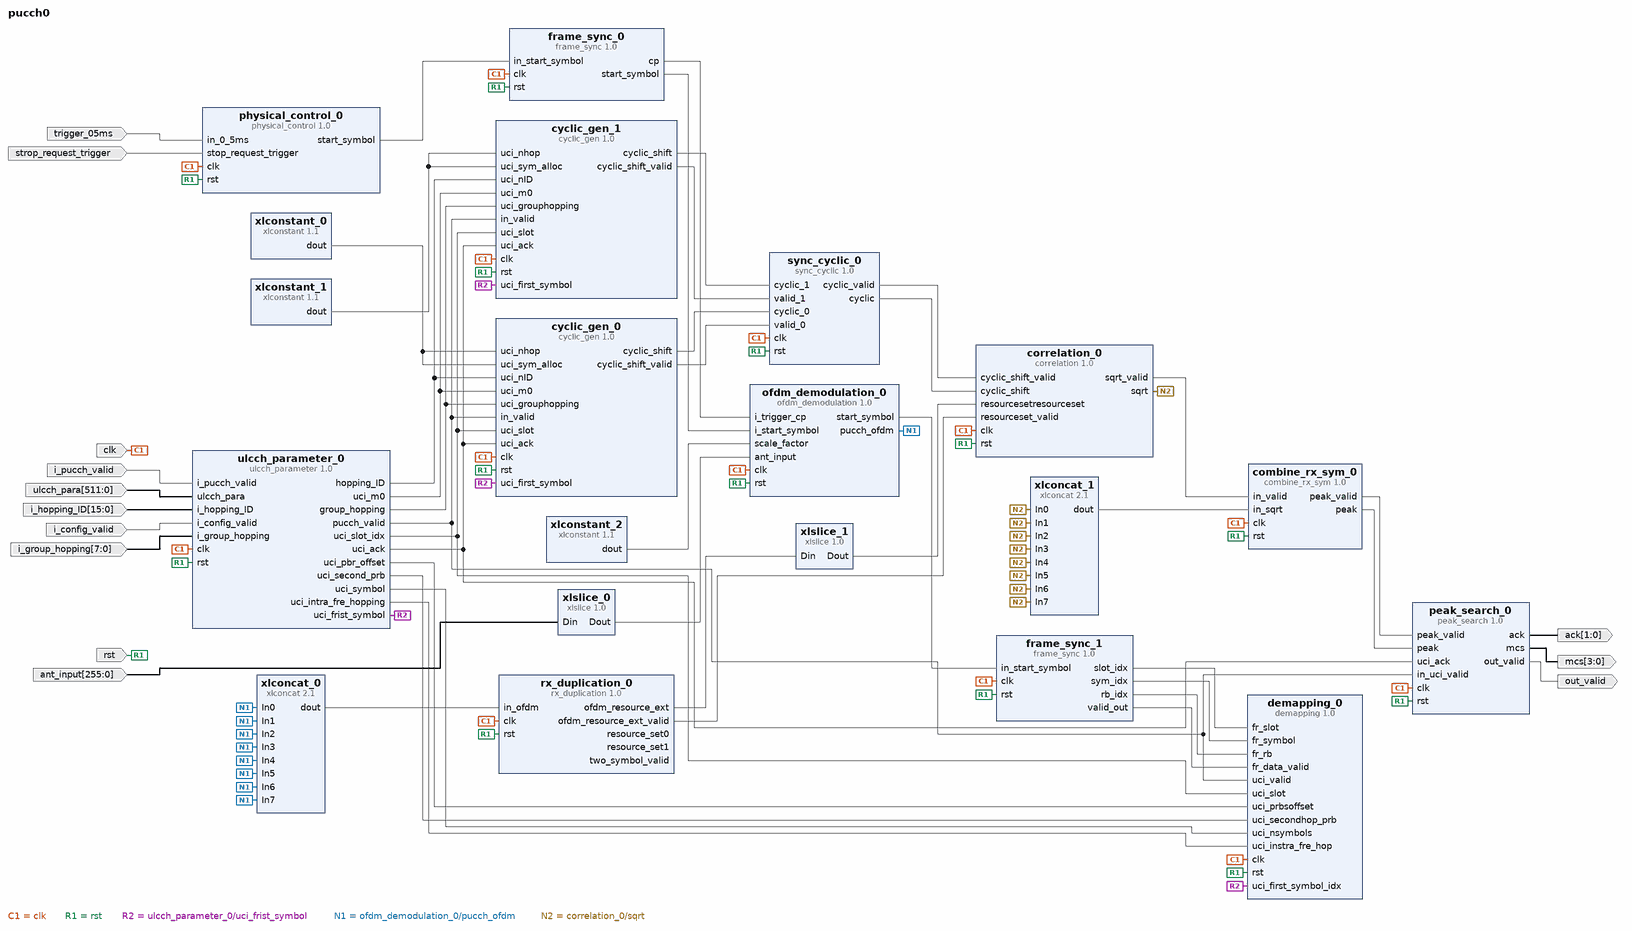
[diagram p0: block diagram of the top level]
# Vivado block design pucch0, xcvu9p-flga2104-2L-e, Vivado 2019.2
create_bd_design pucch0

create_bd_port -dir I -type clk clk
set_property -dict {CONFIG.FREQ_HZ 122880000} [get_bd_ports clk]
create_bd_port -dir I -type rst rst
set_property -dict {CONFIG.POLARITY ACTIVE_HIGH} [get_bd_ports rst]
create_bd_port -dir I trigger_05ms
create_bd_port -dir I strop_request_trigger
create_bd_port -dir I i_pucch_valid
create_bd_port -dir I -from 511 -to 0 -type data ulcch_para
create_bd_port -dir I -from 7 -to 0 i_group_hopping
create_bd_port -dir O out_valid
create_bd_port -dir O -from 1 -to 0 ack
create_bd_port -dir O -from 3 -to 0 mcs
create_bd_port -dir I -from 255 -to 0 ant_input
create_bd_port -dir I -from 15 -to 0 i_hopping_ID
create_bd_port -dir I i_config_valid

create_bd_cell -type ip -vlnv xilinx.com:user:physical_control:1.0 physical_control_0
create_bd_cell -type ip -vlnv xilinx.com:user:peak_search:1.0 peak_search_0
create_bd_cell -type ip -vlnv xilinx.com:ip:xlconstant:1.1 xlconstant_0
set_property -dict {CONFIG.CONST_VAL 0} [get_bd_cells xlconstant_0]
create_bd_cell -type ip -vlnv xilinx.com:ip:xlconstant:1.1 xlconstant_1
set_property -dict {CONFIG.CONST_VAL 1} [get_bd_cells xlconstant_1]
create_bd_cell -type ip -vlnv xilinx.com:ip:xlconcat:2.1 xlconcat_0
set_property -dict [list \
  CONFIG.IN0_WIDTH 32 \
  CONFIG.IN1_WIDTH 32 \
  CONFIG.IN2_WIDTH 32 \
  CONFIG.IN3_WIDTH 32 \
  CONFIG.IN4_WIDTH 32 \
  CONFIG.IN5_WIDTH 32 \
  CONFIG.IN6_WIDTH 32 \
  CONFIG.IN7_WIDTH 32 \
  CONFIG.NUM_PORTS 8 \
] [get_bd_cells xlconcat_0]
create_bd_cell -type ip -vlnv xilinx.com:ip:xlconstant:1.1 xlconstant_2
set_property -dict {CONFIG.CONST_VAL 3 CONFIG.CONST_WIDTH 3} [get_bd_cells xlconstant_2]
create_bd_cell -type ip -vlnv xilinx.com:ip:xlslice:1.0 xlslice_0
set_property -dict {CONFIG.DIN_FROM 31 CONFIG.DIN_TO 0 CONFIG.DIN_WIDTH 256 CONFIG.DOUT_WIDTH 32} [get_bd_cells xlslice_0]
create_bd_cell -type ip -vlnv xilinx.com:user:frame_sync:1.0 frame_sync_0
create_bd_cell -type ip -vlnv xilinx.com:user:frame_sync:1.0 frame_sync_1
create_bd_cell -type ip -vlnv xilinx.com:user:cyclic_gen:1.0 cyclic_gen_0
create_bd_cell -type ip -vlnv xilinx.com:user:cyclic_gen:1.0 cyclic_gen_1
create_bd_cell -type ip -vlnv xilinx.com:user:ofdm_demodulation:1.0 ofdm_demodulation_0
create_bd_cell -type ip -vlnv xilinx.com:user:ulcch_parameter:1.0 ulcch_parameter_0
create_bd_cell -type ip -vlnv xilinx.com:ip:xlslice:1.0 xlslice_1
set_property -dict {CONFIG.DIN_FROM 31 CONFIG.DIN_TO 0 CONFIG.DIN_WIDTH 256 CONFIG.DOUT_WIDTH 32} [get_bd_cells xlslice_1]
create_bd_cell -type ip -vlnv xilinx.com:ip:xlconcat:2.1 xlconcat_1
set_property -dict [list \
  CONFIG.IN0_WIDTH 20 \
  CONFIG.IN1_WIDTH 20 \
  CONFIG.IN2_WIDTH 20 \
  CONFIG.IN3_WIDTH 20 \
  CONFIG.IN4_WIDTH 20 \
  CONFIG.IN5_WIDTH 20 \
  CONFIG.IN6_WIDTH 20 \
  CONFIG.IN7_WIDTH 20 \
  CONFIG.NUM_PORTS 8 \
] [get_bd_cells xlconcat_1]
create_bd_cell -type ip -vlnv xilinx.com:user:rx_duplication:1.0 rx_duplication_0
set_property -dict {CONFIG.RX_num 8} [get_bd_cells rx_duplication_0]
create_bd_cell -type ip -vlnv xilinx.com:user:sync_cyclic:1.0 sync_cyclic_0
create_bd_cell -type ip -vlnv xilinx.com:user:correlation:1.0 correlation_0
create_bd_cell -type ip -vlnv xilinx.com:user:combine_rx_sym:1.0 combine_rx_sym_0
create_bd_cell -type ip -vlnv xilinx.com:user:demapping:1.0 demapping_0

# ---- connections ----

connect_bd_net [get_bd_ports clk] \
  [get_bd_pins physical_control_0/clk] [get_bd_pins peak_search_0/clk] [get_bd_pins frame_sync_0/clk] \
  [get_bd_pins frame_sync_1/clk] [get_bd_pins cyclic_gen_0/clk] [get_bd_pins cyclic_gen_1/clk] \
  [get_bd_pins ofdm_demodulation_0/clk] [get_bd_pins ulcch_parameter_0/clk] [get_bd_pins rx_duplication_0/clk] \
  [get_bd_pins sync_cyclic_0/clk] [get_bd_pins correlation_0/clk] [get_bd_pins combine_rx_sym_0/clk] \
  [get_bd_pins demapping_0/clk]
connect_bd_net [get_bd_ports rst] \
  [get_bd_pins physical_control_0/rst] [get_bd_pins peak_search_0/rst] [get_bd_pins frame_sync_0/rst] \
  [get_bd_pins frame_sync_1/rst] [get_bd_pins cyclic_gen_0/rst] [get_bd_pins cyclic_gen_1/rst] \
  [get_bd_pins ofdm_demodulation_0/rst] [get_bd_pins ulcch_parameter_0/rst] [get_bd_pins rx_duplication_0/rst] \
  [get_bd_pins sync_cyclic_0/rst] [get_bd_pins correlation_0/rst] [get_bd_pins combine_rx_sym_0/rst] \
  [get_bd_pins demapping_0/rst]
connect_bd_net [get_bd_ports trigger_05ms] [get_bd_pins physical_control_0/in_0_5ms]
connect_bd_net [get_bd_ports strop_request_trigger] [get_bd_pins physical_control_0/stop_request_trigger]
connect_bd_net [get_bd_pins physical_control_0/start_symbol] [get_bd_pins frame_sync_0/in_start_symbol]
connect_bd_net -net layer2_valid_1 [get_bd_ports i_pucch_valid] [get_bd_pins ulcch_parameter_0/i_pucch_valid]
connect_bd_net -net layer2_para_1 [get_bd_ports ulcch_para] [get_bd_pins ulcch_parameter_0/ulcch_para]
connect_bd_net -net layer2_parameter_0_uci_valid [get_bd_pins ulcch_parameter_0/pucch_valid] \
  [get_bd_pins peak_search_0/in_uci_valid] [get_bd_pins cyclic_gen_0/in_valid] [get_bd_pins cyclic_gen_1/in_valid] \
  [get_bd_pins demapping_0/uci_valid]
connect_bd_net -net slot_ind_1 [get_bd_pins ulcch_parameter_0/uci_slot_idx] \
  [get_bd_pins cyclic_gen_0/uci_slot] [get_bd_pins cyclic_gen_1/uci_slot] [get_bd_pins demapping_0/uci_slot]
connect_bd_net -net layer2_parameter_0_uci_frist_symbol [get_bd_pins ulcch_parameter_0/uci_frist_symbol] \
  [get_bd_pins cyclic_gen_0/uci_first_symbol] [get_bd_pins cyclic_gen_1/uci_first_symbol] \
  [get_bd_pins demapping_0/uci_first_symbol_idx]
# net demapping_0_resoureset0_valid has one end: rx_duplication_0/resource_set0
# net demapping_0_resoureset1_valid has one end: rx_duplication_0/resource_set1
# net demapping_0_two_symbol_valid has one end: rx_duplication_0/two_symbol_valid
connect_bd_net -net layer2_parameter_0_uci_nid [get_bd_pins ulcch_parameter_0/hopping_ID] \
  [get_bd_pins cyclic_gen_0/uci_nID] [get_bd_pins cyclic_gen_1/uci_nID]
connect_bd_net -net layer2_parameter_0_uci_m0 [get_bd_pins ulcch_parameter_0/uci_m0] \
  [get_bd_pins cyclic_gen_0/uci_m0] [get_bd_pins cyclic_gen_1/uci_m0]
connect_bd_net -net layer2_parameter_0_uci_ack [get_bd_pins ulcch_parameter_0/uci_ack] \
  [get_bd_pins peak_search_0/uci_ack] [get_bd_pins cyclic_gen_0/uci_ack] [get_bd_pins cyclic_gen_1/uci_ack]
connect_bd_net -net group_hopping_1 [get_bd_pins ulcch_parameter_0/group_hopping] \
  [get_bd_pins cyclic_gen_0/uci_grouphopping] [get_bd_pins cyclic_gen_1/uci_grouphopping]
connect_bd_net -net xlconstant_0_dout [get_bd_pins xlconstant_1/dout] [get_bd_pins cyclic_gen_1/uci_sym_alloc] [get_bd_pins cyclic_gen_1/uci_nhop]
connect_bd_net [get_bd_pins sync_cyclic_0/cyclic_valid] [get_bd_pins correlation_0/cyclic_shift_valid]
connect_bd_net [get_bd_pins sync_cyclic_0/cyclic] [get_bd_pins correlation_0/cyclic_shift]
connect_bd_net [get_bd_pins rx_duplication_0/ofdm_resource_ext_valid] [get_bd_pins correlation_0/resourceset_valid]
connect_bd_net [get_bd_pins correlation_0/sqrt_valid] [get_bd_pins combine_rx_sym_0/in_valid]
connect_bd_net [get_bd_pins combine_rx_sym_0/peak_valid] [get_bd_pins peak_search_0/peak_valid]
connect_bd_net [get_bd_pins combine_rx_sym_0/peak] [get_bd_pins peak_search_0/peak]
connect_bd_net [get_bd_pins peak_search_0/ack] [get_bd_ports ack]
connect_bd_net [get_bd_pins peak_search_0/out_valid] [get_bd_ports out_valid]
connect_bd_net [get_bd_pins peak_search_0/mcs] [get_bd_ports mcs]
connect_bd_net [get_bd_pins frame_sync_1/slot_idx] [get_bd_pins demapping_0/fr_slot]
connect_bd_net [get_bd_pins frame_sync_1/sym_idx] [get_bd_pins demapping_0/fr_symbol]
connect_bd_net [get_bd_pins frame_sync_1/rb_idx] [get_bd_pins demapping_0/fr_rb]
connect_bd_net [get_bd_pins frame_sync_1/valid_out] [get_bd_pins demapping_0/fr_data_valid]
connect_bd_net [get_bd_pins frame_sync_0/cp] [get_bd_pins ofdm_demodulation_0/i_trigger_cp]
connect_bd_net [get_bd_pins frame_sync_0/start_symbol] [get_bd_pins ofdm_demodulation_0/i_start_symbol]
connect_bd_net [get_bd_pins xlconstant_2/dout] [get_bd_pins ofdm_demodulation_0/scale_factor]
connect_bd_net -net ofdm_demodulation_v2_0_pucch_ofdm [get_bd_pins ofdm_demodulation_0/pucch_ofdm] \
  [get_bd_pins xlconcat_0/In0] [get_bd_pins xlconcat_0/In1] [get_bd_pins xlconcat_0/In2] [get_bd_pins xlconcat_0/In3] \
  [get_bd_pins xlconcat_0/In4] [get_bd_pins xlconcat_0/In5] [get_bd_pins xlconcat_0/In6] [get_bd_pins xlconcat_0/In7]
connect_bd_net [get_bd_pins xlconcat_0/dout] [get_bd_pins rx_duplication_0/in_ofdm]
connect_bd_net [get_bd_ports ant_input] [get_bd_pins xlslice_0/Din]
connect_bd_net [get_bd_pins xlslice_0/Dout] [get_bd_pins ofdm_demodulation_0/ant_input]
connect_bd_net -net xlconstant_1_dout [get_bd_pins xlconstant_0/dout] [get_bd_pins cyclic_gen_0/uci_sym_alloc] [get_bd_pins cyclic_gen_0/uci_nhop]
connect_bd_net [get_bd_pins ofdm_demodulation_0/start_symbol] [get_bd_pins frame_sync_1/in_start_symbol]
connect_bd_net [get_bd_ports i_hopping_ID] [get_bd_pins ulcch_parameter_0/i_hopping_ID]
connect_bd_net [get_bd_ports i_config_valid] [get_bd_pins ulcch_parameter_0/i_config_valid]
connect_bd_net [get_bd_pins ulcch_parameter_0/uci_pbr_offset] [get_bd_pins demapping_0/uci_prbsoffset]
connect_bd_net [get_bd_pins ulcch_parameter_0/uci_second_prb] [get_bd_pins demapping_0/uci_secondhop_prb]
connect_bd_net [get_bd_pins ulcch_parameter_0/uci_symbol] [get_bd_pins demapping_0/uci_nsymbols]
connect_bd_net [get_bd_pins ulcch_parameter_0/uci_intra_fre_hopping] [get_bd_pins demapping_0/uci_instra_fre_hop]
connect_bd_net [get_bd_ports i_group_hopping] [get_bd_pins ulcch_parameter_0/i_group_hopping]
connect_bd_net [get_bd_pins rx_duplication_0/ofdm_resource_ext] [get_bd_pins xlslice_1/Din]
connect_bd_net [get_bd_pins xlslice_1/Dout] [get_bd_pins correlation_0/resourcesetresourceset]
connect_bd_net [get_bd_pins correlation_0/sqrt] \
  [get_bd_pins xlconcat_1/In0] [get_bd_pins xlconcat_1/In1] [get_bd_pins xlconcat_1/In2] [get_bd_pins xlconcat_1/In3] \
  [get_bd_pins xlconcat_1/In4] [get_bd_pins xlconcat_1/In5] [get_bd_pins xlconcat_1/In6] [get_bd_pins xlconcat_1/In7]
connect_bd_net [get_bd_pins xlconcat_1/dout] [get_bd_pins combine_rx_sym_0/in_sqrt]
connect_bd_net [get_bd_pins cyclic_gen_1/cyclic_shift] [get_bd_pins sync_cyclic_0/cyclic_1]
connect_bd_net [get_bd_pins cyclic_gen_0/cyclic_shift] [get_bd_pins sync_cyclic_0/cyclic_0]
connect_bd_net [get_bd_pins cyclic_gen_1/cyclic_shift_valid] [get_bd_pins sync_cyclic_0/valid_1]
connect_bd_net [get_bd_pins cyclic_gen_0/cyclic_shift_valid] [get_bd_pins sync_cyclic_0/valid_0]

validate_bd_design
save_bd_design
